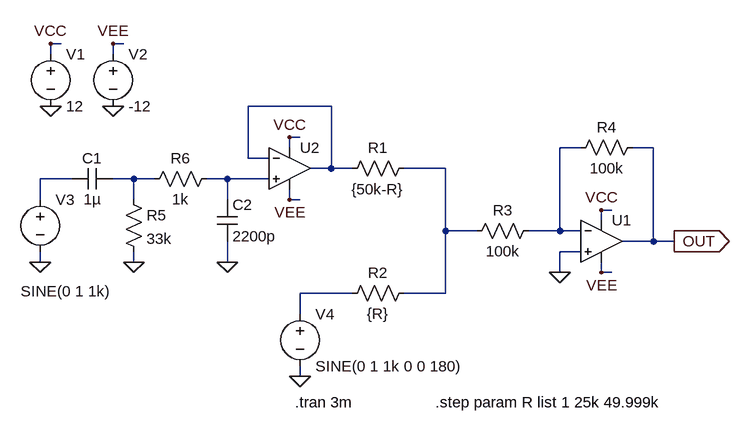
[diagram p0: schematic Dry_Wet_FV-1_Buffered_Test_01.asc]
Dry_Wet_FV-1_Buffered_Test_01.asc, the LTspice schematic file:
Version 4
SHEET 1 880 680
WIRE -384 -112 -400 -112
WIRE -288 -112 -304 -112
WIRE -400 -96 -400 -112
WIRE -304 -96 -304 -112
WIRE 32 -16 -96 -16
WIRE -16 32 -32 32
WIRE -32 48 -32 32
WIRE 416 48 384 48
WIRE 528 48 496 48
WIRE -96 64 -96 -16
WIRE -64 64 -96 64
WIRE 32 80 32 -16
WIRE 32 80 0 80
WIRE 64 80 32 80
WIRE 208 80 144 80
WIRE -368 96 -416 96
WIRE -272 96 -304 96
WIRE -240 96 -272 96
WIRE -128 96 -160 96
WIRE -64 96 -128 96
WIRE -416 128 -416 96
WIRE -272 128 -272 96
WIRE -128 128 -128 96
WIRE -32 128 -32 112
WIRE -16 128 -32 128
WIRE 464 144 448 144
WIRE 448 160 448 144
WIRE 208 176 208 80
WIRE 256 176 208 176
WIRE 384 176 384 48
WIRE 384 176 336 176
WIRE 416 176 384 176
WIRE 528 192 528 48
WIRE 528 192 480 192
WIRE 560 192 528 192
WIRE 416 208 384 208
WIRE -416 224 -416 208
WIRE -272 224 -272 208
WIRE -128 224 -128 192
WIRE 384 240 384 208
WIRE 448 240 448 224
WIRE 464 240 448 240
WIRE 64 272 -16 272
WIRE 208 272 208 176
WIRE 208 272 144 272
WIRE -16 304 -16 272
WIRE -16 400 -16 384
FLAG 448 144 VCC
FLAG 448 240 VEE
FLAG 384 240 0
FLAG 560 192 OUT
IOPIN 560 192 Out
FLAG -400 -16 0
FLAG -304 -16 0
FLAG -400 -112 VCC
FLAG -304 -112 VEE
FLAG -416 224 0
FLAG -16 400 0
FLAG -272 224 0
FLAG -128 224 0
FLAG -32 32 VCC
FLAG -32 128 VEE
SYMBOL res 160 64 R90
WINDOW 0 0 56 VBottom 2
WINDOW 3 32 56 VTop 2
SYMATTR InstName R1
SYMATTR Value {50k-R}
SYMBOL res 160 256 R90
WINDOW 0 0 56 VBottom 2
WINDOW 3 32 56 VTop 2
SYMATTR InstName R2
SYMATTR Value {R}
SYMBOL res 352 160 R90
WINDOW 0 0 56 VBottom 2
WINDOW 3 32 56 VTop 2
SYMATTR InstName R3
SYMATTR Value 100k
SYMBOL Opamps\\UniversalOpamp2 448 192 R0
SYMATTR InstName U1
SYMBOL res 512 32 R90
WINDOW 0 0 56 VBottom 2
WINDOW 3 32 56 VTop 2
SYMATTR InstName R4
SYMATTR Value 100k
SYMBOL voltage -400 -112 R0
WINDOW 123 0 0 Left 0
WINDOW 39 0 0 Left 0
SYMATTR InstName V1
SYMATTR Value 12
SYMBOL voltage -304 -112 R0
WINDOW 123 0 0 Left 0
WINDOW 39 0 0 Left 0
SYMATTR InstName V2
SYMATTR Value -12
SYMBOL voltage -416 112 R0
WINDOW 123 0 0 Left 0
WINDOW 39 0 0 Left 0
WINDOW 3 -30 157 Left 2
SYMATTR Value SINE(0 1 1k)
SYMATTR InstName V3
SYMBOL voltage -16 288 R0
WINDOW 123 0 0 Left 0
WINDOW 39 0 0 Left 0
SYMATTR InstName V4
SYMATTR Value SINE(0 1 1k 0 0 180)
SYMBOL cap -304 80 R90
WINDOW 0 0 32 VBottom 2
WINDOW 3 32 32 VTop 2
SYMATTR InstName C1
SYMATTR Value 1µ
SYMBOL res -288 112 R0
SYMATTR InstName R5
SYMATTR Value 33k
SYMBOL res -144 80 R90
WINDOW 0 0 56 VBottom 2
WINDOW 3 32 56 VTop 2
SYMATTR InstName R6
SYMATTR Value 1k
SYMBOL cap -144 128 R0
SYMATTR InstName C2
SYMATTR Value 2200p
SYMBOL Opamps\\UniversalOpamp2 -32 80 R0
SYMATTR InstName U2
TEXT -24 440 Left 2 !.tran 3m
TEXT 192 440 Left 2 !.step param R list 1 25k 49.999k

The netlist it stands for:
* Dry_Wet_FV-1_Buffered_Test_01.asc
R1 N003 N001 {50k-R}
R2 N003 N007 {R}
R3 N002 N003 100k
XU1 0 N002 VCC VEE OUT level.2 Avol=1Meg GBW=10Meg Slew=10Meg ilimit=25m rail=0 Vos=0 phimargin=45 en=0 enk=0 in=0 ink=0 Rin=500Meg  ; pins IN+ IN- V+ V- OUT
R4 OUT N002 100k
V1 VCC 0 12
V2 VEE 0 -12
V3 N004 0 SINE(0 1 1k)
V4 N007 0 SINE(0 1 1k 0 0 180)
C1 N005 N004 1µ
R5 N005 0 33k
R6 N006 N005 1k
C2 N006 0 2200p
XU2 N006 N001 VCC VEE N001 level.2 Avol=1Meg GBW=10Meg Slew=10Meg ilimit=25m rail=0 Vos=0 phimargin=45 en=0 enk=0 in=0 ink=0 Rin=500Meg  ; pins IN+ IN- V+ V- OUT
.tran 3m
.step param R list 1 25k 49.999k
.lib UniversalOpamps2.sub
.backanno
.end